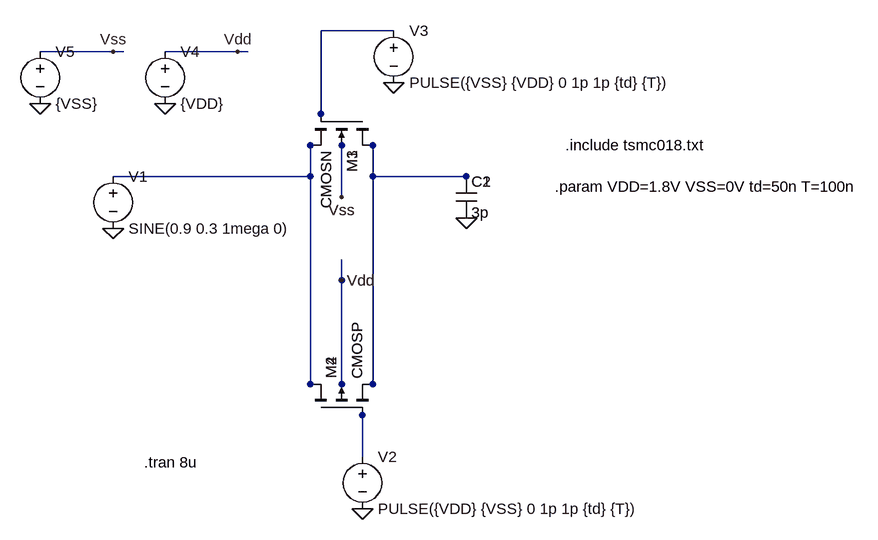
[diagram p0: schematic SnH1.asc]
SnH1.asc, the LTspice schematic file:
Version 4
SHEET 1 1484 680
WIRE 432 -176 320 -176
WIRE 0 -144 -112 -144
WIRE 16 -144 0 -144
WIRE 192 -144 80 -144
WIRE 208 -144 192 -144
WIRE 320 -48 320 -176
WIRE 304 48 304 0
WIRE 304 48 0 48
WIRE 400 48 400 0
WIRE 544 48 400 48
WIRE 352 80 352 0
WIRE 352 208 352 176
WIRE 304 368 304 48
WIRE 352 368 352 208
WIRE 400 368 400 48
WIRE 384 480 384 416
WIRE 304 48 304 0
WIRE 400 48 400 0
WIRE 544 48 400 48
WIRE 352 80 352 0
WIRE 352 208 352 176
WIRE 304 368 304 48
WIRE 352 368 352 208
WIRE 400 368 400 48
FLAG 432 -96 0
FLAG 384 560 0
FLAG 544 112 0
FLAG 0 128 0
FLAG 80 -64 0
FLAG 192 -144 Vdd
FLAG 352 208 Vdd
FLAG -112 -64 0
FLAG 0 -144 Vss
FLAG 352 80 Vss
FLAG 544 112 0
FLAG 352 208 Vdd
FLAG 352 80 Vss
SYMBOL voltage 0 32 R0
WINDOW 123 0 0 Left 0
WINDOW 39 0 0 Left 0
SYMATTR InstName V1
SYMATTR Value SINE(0.9 0.3 1mega 0)
SYMBOL voltage 384 464 R0
WINDOW 123 0 0 Left 0
WINDOW 39 0 0 Left 0
SYMATTR InstName V2
SYMATTR Value PULSE({VDD} {VSS} 0 1p 1p {td} {T})
SYMBOL voltage 432 -192 R0
WINDOW 123 0 0 Left 0
WINDOW 39 0 0 Left 0
SYMATTR InstName V3
SYMATTR Value PULSE({VSS} {VDD} 0 1p 1p {td} {T})
SYMBOL cap 528 48 R0
SYMATTR InstName C1
SYMATTR Value 3p
SYMBOL voltage 80 -160 R0
WINDOW 123 0 0 Left 0
WINDOW 39 0 0 Left 0
SYMATTR InstName V4
SYMATTR Value {VDD}
SYMBOL nmos4 400 -48 R90
SYMATTR InstName M1
SYMATTR Value CMOSN
SYMATTR Value2 l=1u w=3u
SYMBOL pmos4 304 416 R270
SYMATTR InstName M2
SYMATTR Value CMOSP
SYMATTR Value2 l=1u w=8u
SYMBOL voltage -112 -160 R0
WINDOW 123 0 0 Left 0
WINDOW 39 0 0 Left 0
SYMATTR InstName V5
SYMATTR Value {VSS}
SYMBOL cap 528 48 R0
SYMATTR InstName C2
SYMATTR Value 3p
SYMBOL nmos4 400 -48 R90
SYMATTR InstName M3
SYMATTR Value CMOSN
SYMATTR Value2 l=1u w=3u
SYMBOL pmos4 304 416 R270
SYMATTR InstName M4
SYMATTR Value CMOSP
SYMATTR Value2 l=1u w=8u
TEXT 48 488 Left 2 !.tran 8u
TEXT 696 0 Left 2 !.include tsmc018.txt
TEXT 680 64 Left 2 !.param VDD=1.8V VSS=0V td=50n T=100n

The netlist it stands for:
* SnH1.asc
V1 N002 0 SINE(0.9 0.3 1mega 0)
V2 N004 0 PULSE({VDD} {VSS} 0 1p 1p {td} {T})
V3 N001 0 PULSE({VSS} {VDD} 0 1p 1p {td} {T})
C1 N003 0 3p
V4 Vdd 0 {VDD}
M1 N003 N001 N002 Vss CMOSN l=1u w=3u
M2 N002 N004 N003 Vdd CMOSP l=1u w=8u
V5 Vss 0 {VSS}
C2 N003 0 3p
M3 N003 N001 N002 Vss CMOSN l=1u w=3u
M4 N002 N004 N003 Vdd CMOSP l=1u w=8u
.model NMOS NMOS
.model PMOS PMOS
.lib standard.mos
.tran 8u
.include tsmc018.txt
.param VDD=1.8V VSS=0V td=50n T=100n
.backanno
.end